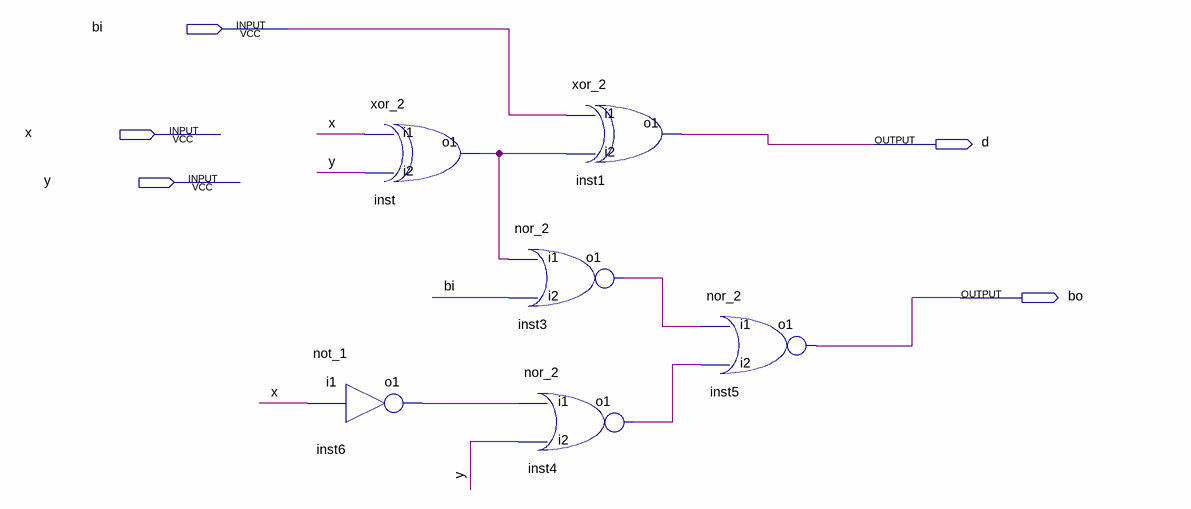
[diagram p0: schematic sheet]
// Quartus schematic FullSubtracter1.bdf as structural Verilog: 6 symbols, 5 pins
module FullSubtracter1 (
  input  bi,
  input  x,
  input  y,
  output d,
  output bo
);

  wire inst3_o1, inst4_o1, inst6_o1, inst_o1;

  not_1 inst6 (.i1(x), .o1(inst6_o1));
  xor_2 inst (.i1(x), .i2(y), .o1(inst_o1));
  xor_2 inst1 (.i1(bi), .i2(inst_o1), .o1(d));
  nor_2 inst3 (.i1(inst_o1), .i2(bi), .o1(inst3_o1));
  nor_2 inst4 (.i1(inst6_o1), .i2(y), .o1(inst4_o1));
  nor_2 inst5 (.i1(inst3_o1), .i2(inst4_o1), .o1(bo));
endmodule
